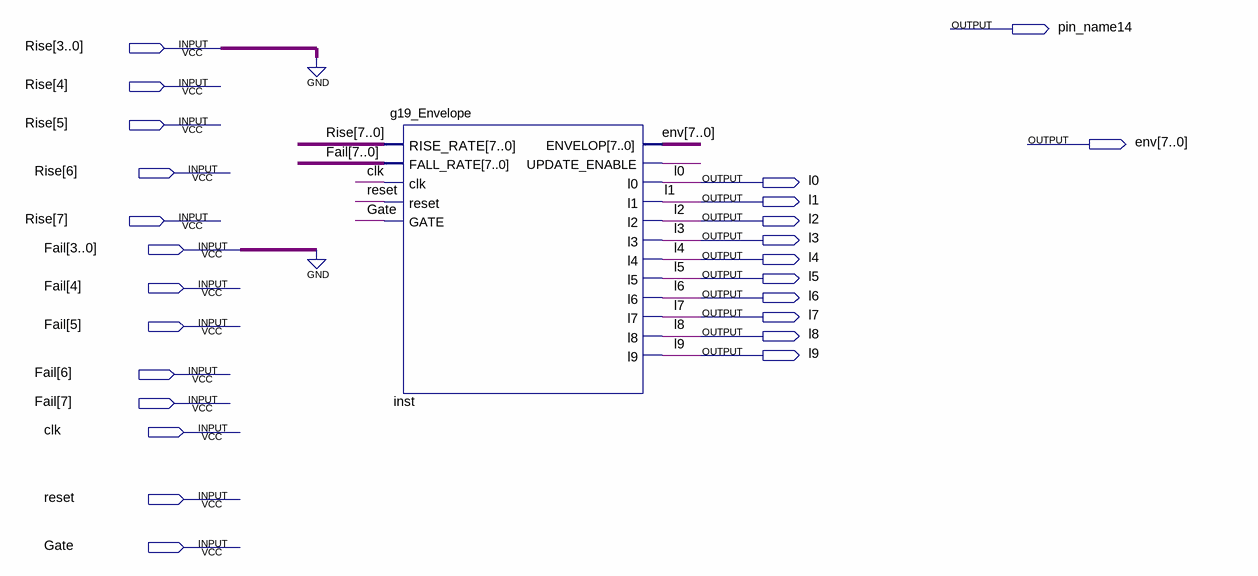
[diagram p0: schematic sheet]
// Quartus schematic G19_envelope.bdf as structural Verilog: 1 symbols, 25 pins
module G19_envelope (
  input  [7:0] Rise,
  input  [7:0] Fail,
  input  clk,
  input  reset,
  input  Gate,
  output pin_name14,
  output [7:0] env,
  output l0,
  output l1,
  output l2,
  output l3,
  output l4,
  output l5,
  output l6,
  output l7,
  output l8,
  output l9
);

  wire inst_update_enable;

  g19_Envelope inst (
    .RISE_RATE(Rise), .FALL_RATE(Fail), .clk(clk), .reset(reset), .GATE(Gate), .ENVELOP(env),
    .UPDATE_ENABLE(inst_update_enable), .l0(l0), .l1(l1), .l2(l2), .l3(l3), .l4(l4), .l5(l5), .l6(l6),
    .l7(l7), .l8(l8), .l9(l9));
  // also tied to GND on the sheet: {Fail[0], Fail[1], Fail[2], Fail[3], Rise[0], Rise[1], Rise[2], Rise[3]}
endmodule
